# Altium schematic sheet E17-04-MCU.SchDoc
size A4; DocumentNumber: 5; SheetNumber: 5; SheetTotal: 18
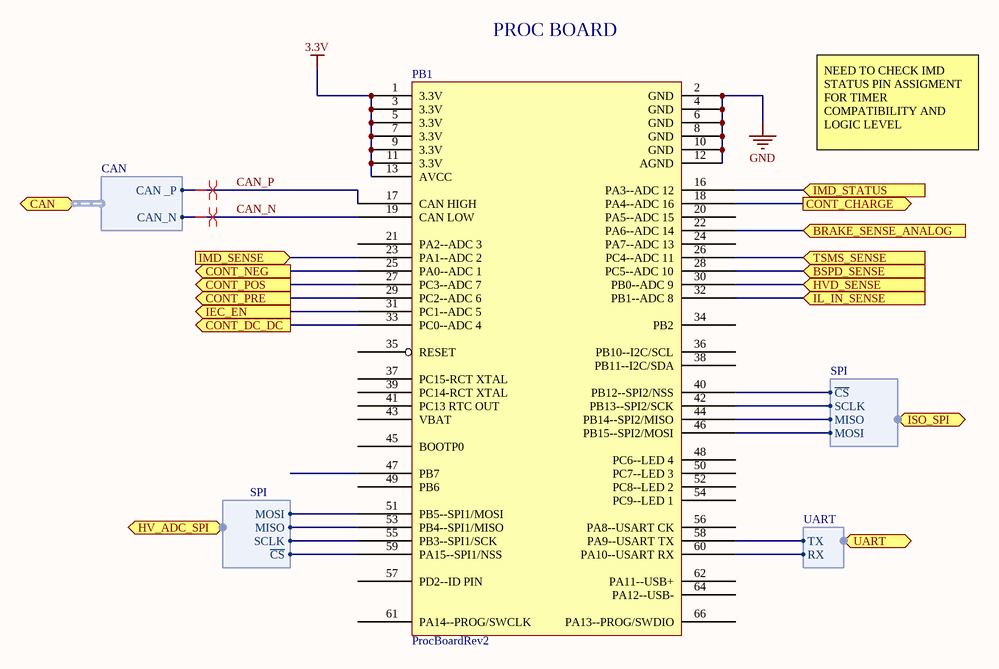
[diagram p0: E17-04-MCU.SchDoc]

## Parts
PB1  ProcBoardRev2  [PROC_BOARD]

## Ports
BRAKE_SENSE_ANALOG (in), BSPD_SENSE (in), CAN (harness CAN), CONT_CHARGE (out), CONT_DC_DC (out), CONT_NEG (out), CONT_POS (out), CONT_PRE (out), HV_ADC_SPI (harness SPI), HVD_SENSE (in), IEC_EN (out), IL_IN_SENSE (in), IMD_SENSE (in), IMD_STATUS (in), ISO_SPI (harness SPI), TSMS_SENSE (in), UART (harness UART)

## Harnesses
CAN: CAN _P, CAN_N
SPI: ~{CS}, MOSI, MISO, SCLK
UART: RX, TX

## Nets
3.3V: PB1.1(3.3V) PB1.3(3.3V) PB1.5(3.3V) PB1.7(3.3V) PB1.9(3.3V) PB1.11(3.3V) PB1.13(AVCC)
GND: PB1.2(GND) PB1.4(GND) PB1.6(GND) PB1.8(GND) PB1.10(GND) PB1.12(AGND)
BRAKE_SENSE_ANALOG: PB1.22(PA6--ADC_14) ; port BRAKE_SENSE_ANALOG
BSPD_SENSE: PB1.28(PC5--ADC_10) ; port BSPD_SENSE
CAN_N: PB1.19(CAN_LOW) ; port CAN.CAN_N
CAN_P: PB1.17(CAN_HIGH) ; port CAN.CAN _P
CONT_CHARGE: PB1.18(PA4--ADC_16) ; port CONT_CHARGE
CONT_DC_DC: PB1.33(PC0--ADC_4) ; port CONT_DC_DC
CONT_NEG: PB1.25(PA0--ADC_1) ; port CONT_NEG
CONT_POS: PB1.27(PC3--ADC_7) ; port CONT_POS
CONT_PRE: PB1.29(PC2--ADC_6) ; port CONT_PRE
HVD_SENSE: PB1.30(PB0--ADC_9) ; port HVD_SENSE
IEC_EN: PB1.31(PC1--ADC_5) ; port IEC_EN
IL_IN_SENSE: PB1.32(PB1--ADC_8) ; port IL_IN_SENSE
IMD_SENSE: PB1.23(PA1--ADC_2) ; port IMD_SENSE
IMD_STATUS: PB1.16(PA3--ADC_12) ; port IMD_STATUS
TSMS_SENSE: PB1.26(PC4--ADC_11) ; port TSMS_SENSE
NetPB1_40: PB1.40(PB12--SPI2/NSS) ; port ISO_SPI.~{CS}
NetPB1_42: PB1.42(PB13--SPI2/SCK) ; port ISO_SPI.SCLK
NetPB1_44: PB1.44(PB14--SPI2/MISO) ; port ISO_SPI.MISO
NetPB1_46: PB1.46(PB15--SPI2/MOSI) ; port ISO_SPI.MOSI
NetPB1_51: PB1.51(PB5--SPI1/MOSI) ; port HV_ADC_SPI.MOSI
NetPB1_53: PB1.53(PB4--SPI1/MISO) ; port HV_ADC_SPI.MISO
NetPB1_55: PB1.55(PB3--SPI1/SCK) ; port HV_ADC_SPI.SCLK
NetPB1_58: PB1.58(PA9--USART_TX) ; port UART.TX
NetPB1_59: PB1.59(PA15--SPI1/NSS) ; port HV_ADC_SPI.~{CS}
NetPB1_60: PB1.60(PA10--USART_RX) ; port UART.RX

Not connected (* = marked no-connect by the designer): PB1 14(NC) 15(NC) 20(PA5--ADC_15) 21(PA2--ADC_3) 24(PA7--ADC_13) 34(PB2) 35(RESET) 36(PB10--I2C/SCL) 37(PC15-RCT_XTAL) 38(PB11--I2C/SDA) 39(PC14-RCT_XTAL) 41(PC13_RTC_OUT) 43(VBAT) 45(BOOTP0) 47(PB7) 48(PC6--LED_4) 49(PB6) 50(PC7--LED_3) 52(PC8--LED_2) 54(PC9--LED_1) 56(PA8--USART_CK) 57(PD2--ID_PIN) 61(PA14--PROG/SWCLK) 62(PA11--USB+) 63(NC) 64(PA12--USB-) 65(NC) 66(PA13--PROG/SWDIO) 67

## Layout directives
differential pair: CAN_N, CAN_P

## Notes on the sheet
- PROC BOARD
- NEED TO CHECK IMD STATUS PIN ASSIGMENT FOR TIMER COMPATIBILITY AND LOGIC LEVEL

## Library data of the parts
PB1 = ProcBoardRev2: Processor board that carries the STM32F072RB